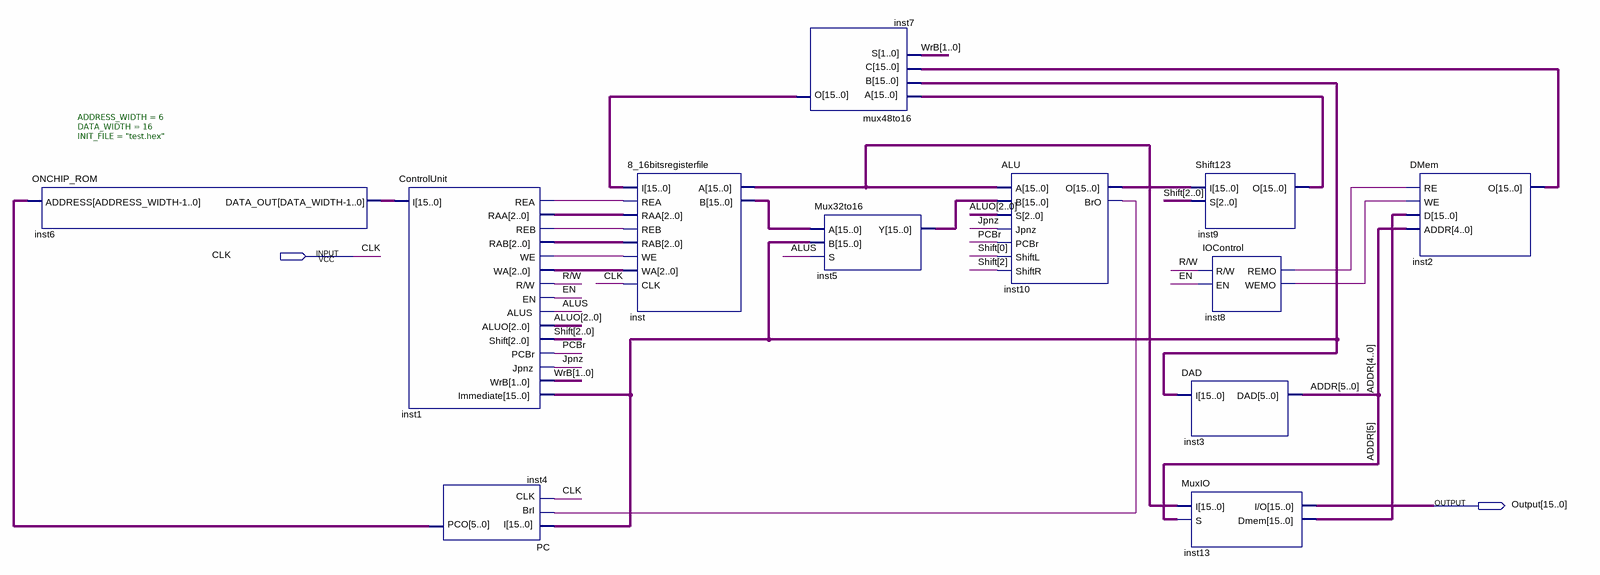
[diagram p0: schematic sheet]
// Quartus schematic DataPath.bdf as structural Verilog: 12 symbols, 2 pins
module DataPath (
  input  CLK,
  output [15:0] Output
);

  wire ALUS, EN, inst1_rea, inst1_reb, inst1_we, inst8_remo, inst8_wemo, inst10_bro, Jpnz, PCBr, \R/W ;
  wire [1:0] WrB;
  wire [2:0] ALUO, inst1_raa, inst1_rab, inst1_wa, Shift;
  wire [5:0] ADDR, inst4_pco;
  wire [15:0] inst1_immediate, inst2_o, inst5_y, inst6_data_out, inst7_o, inst9_o, inst10_o, inst13_dmem,
       inst_a, inst_b;

  ONCHIP_ROM #(.ADDRESS_WIDTH(6), .DATA_WIDTH(16), .INIT_FILE("test.hex")) inst6 (
    .ADDRESS(inst4_pco), .DATA_OUT(inst6_data_out));
  ControlUnit inst1 (
    .I(inst6_data_out), .REA(inst1_rea), .RAA(inst1_raa), .REB(inst1_reb), .RAB(inst1_rab), .WE(inst1_we),
    .WA(inst1_wa), .\R/W (\R/W ), .EN(EN), .ALUS(ALUS), .ALUO(ALUO), .Shift(Shift), .PCBr(PCBr), .Jpnz(Jpnz),
    .WrB(WrB), .Immediate(inst1_immediate));
  PC inst4 (.I(inst1_immediate), .BrI(inst10_bro), .CLK(CLK), .PCO(inst4_pco));
  \8_16bitsregisterfile  inst (
    .I(inst7_o), .REA(inst1_rea), .RAA(inst1_raa), .REB(inst1_reb), .RAB(inst1_rab), .WE(inst1_we),
    .WA(inst1_wa), .CLK(CLK), .A(inst_a), .B(inst_b));
  mux48to16 inst7 (.A(inst9_o), .B(inst1_immediate), .C(inst2_o), .S(WrB), .O(inst7_o));
  Mux32to16 inst5 (.A(inst_b), .B(inst1_immediate), .S(ALUS), .Y(inst5_y));
  ALU inst10 (
    .A(inst_a), .B(inst5_y), .S(ALUO), .Jpnz(Jpnz), .PCBr(PCBr), .ShiftL(Shift[0]), .ShiftR(Shift[2]),
    .O(inst10_o), .BrO(inst10_bro));
  DAD inst3 (.I(inst1_immediate), .DAD(ADDR));
  MuxIO inst13 (.I(inst_a), .S(ADDR[5]), .\I/O (Output), .Dmem(inst13_dmem));
  Shift123 inst9 (.I(inst10_o), .S(Shift), .O(inst9_o));
  IOControl inst8 (.\R/W (\R/W ), .EN(EN), .REMO(inst8_remo), .WEMO(inst8_wemo));
  DMem inst2 (.RE(inst8_remo), .WE(inst8_wemo), .D(inst13_dmem), .ADDR(ADDR[4:0]), .O(inst2_o));
endmodule
